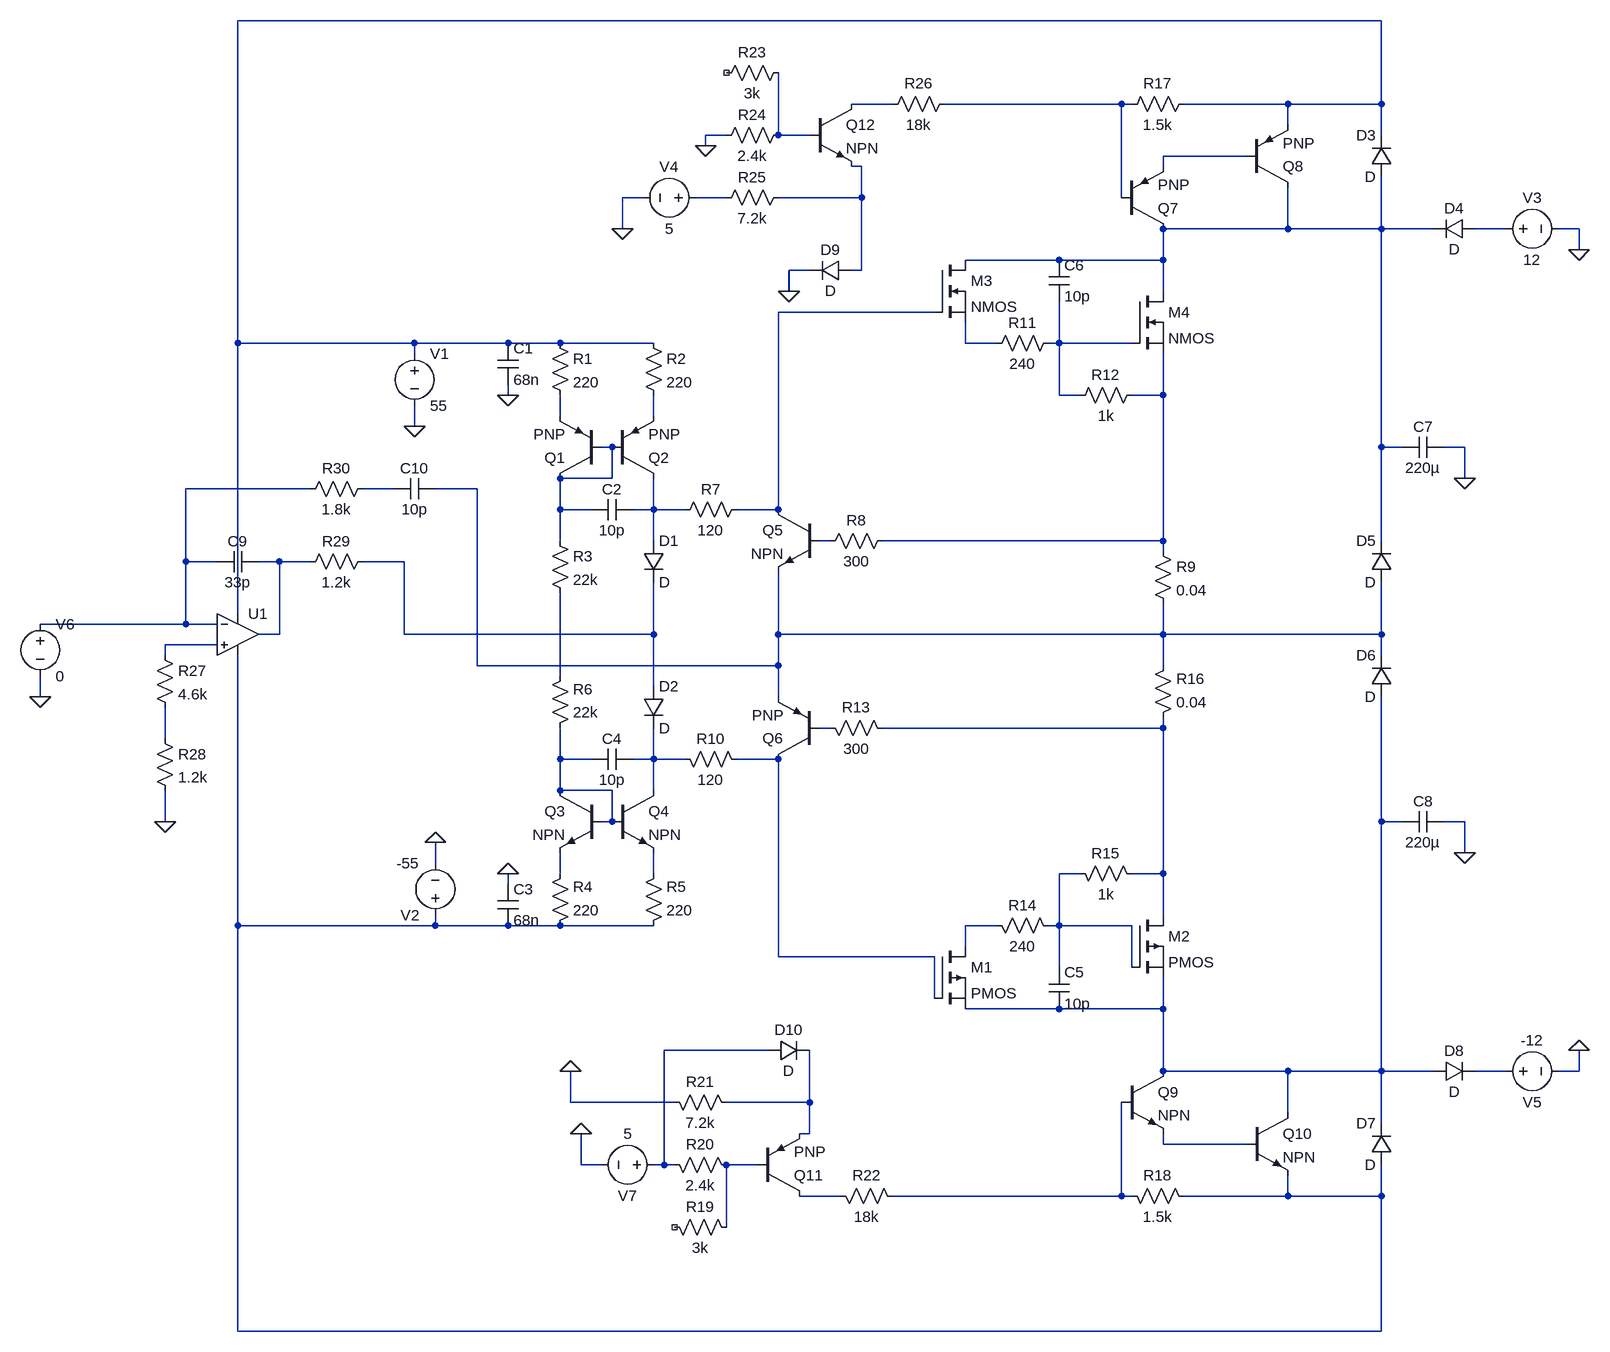
[diagram p0: schematic Модель главного усилителя канал базы.asc]
Модель главного усилителя канал базы.asc, the LTspice schematic file:
Version 4
SHEET 1 1748 1604
WIRE 1424 -416 -336 -416
WIRE 672 -288 608 -288
WIRE 1024 -288 752 -288
WIRE 1040 -288 1024 -288
WIRE 1280 -288 1120 -288
WIRE 1424 -288 1424 -416
WIRE 1424 -288 1280 -288
WIRE 1280 -256 1280 -288
WIRE 416 -240 384 -240
WIRE 496 -240 496 -336
WIRE 544 -240 496 -240
WIRE 1424 -240 1424 -288
WIRE 384 -224 384 -240
WIRE 1216 -208 1088 -208
WIRE 624 -192 608 -192
WIRE 1088 -192 1088 -208
WIRE 288 -144 256 -144
WIRE 416 -144 368 -144
WIRE 624 -144 624 -192
WIRE 624 -144 496 -144
WIRE 1024 -144 1024 -288
WIRE 256 -96 256 -144
WIRE 1280 -96 1280 -160
WIRE 1280 -96 1088 -96
WIRE 1424 -96 1424 -176
WIRE 1424 -96 1280 -96
WIRE 1504 -96 1424 -96
WIRE 1616 -96 1568 -96
WIRE 1728 -96 1696 -96
WIRE 1728 -64 1728 -96
WIRE 928 -48 784 -48
WIRE 1088 -48 1088 -96
WIRE 1088 -48 928 -48
WIRE 544 -32 512 -32
WIRE 624 -32 624 -144
WIRE 624 -32 608 -32
WIRE 512 0 512 -32
WIRE 1088 0 1088 -48
WIRE 736 32 496 32
WIRE -336 80 -336 -416
WIRE -64 80 -336 80
WIRE 80 80 -64 80
WIRE 160 80 80 80
WIRE 304 80 160 80
WIRE 784 80 784 48
WIRE 832 80 784 80
WIRE 928 80 928 16
WIRE 928 80 912 80
WIRE 1040 80 928 80
WIRE -64 96 -64 80
WIRE 80 160 80 144
WIRE 928 160 928 80
WIRE 960 160 928 160
WIRE 1088 160 1088 96
WIRE 1088 160 1040 160
WIRE 160 192 160 160
WIRE 304 192 304 160
WIRE -64 208 -64 176
WIRE 240 240 224 240
WIRE 1424 240 1424 -96
WIRE 1456 240 1424 240
WIRE 1552 240 1520 240
WIRE 240 288 240 240
WIRE 240 288 160 288
WIRE 1552 288 1552 240
WIRE -224 304 -416 304
WIRE -96 304 -144 304
WIRE 32 304 -32 304
WIRE 160 336 160 288
WIRE 208 336 160 336
WIRE 304 336 304 288
WIRE 304 336 272 336
WIRE 352 336 304 336
WIRE 496 336 496 32
WIRE 496 336 432 336
WIRE 160 384 160 336
WIRE 304 384 304 336
WIRE 576 384 560 384
WIRE 1088 384 1088 160
WIRE 1088 384 656 384
WIRE 1424 384 1424 240
WIRE 1088 400 1088 384
WIRE -416 416 -416 304
WIRE -368 416 -416 416
WIRE -272 416 -304 416
WIRE -224 416 -272 416
WIRE -80 416 -144 416
WIRE -336 496 -336 80
WIRE -416 512 -416 416
WIRE -416 512 -640 512
WIRE -368 512 -416 512
WIRE -272 528 -272 416
WIRE -272 528 -304 528
WIRE -80 528 -80 416
WIRE 304 528 304 448
WIRE 304 528 -80 528
WIRE 496 528 496 432
WIRE 1088 528 1088 480
WIRE 1088 528 496 528
WIRE 1424 528 1424 448
WIRE 1424 528 1088 528
WIRE -368 544 -448 544
WIRE -448 560 -448 544
WIRE 1424 560 1424 528
WIRE 32 576 32 304
WIRE 496 576 496 528
WIRE 496 576 32 576
WIRE 1088 576 1088 528
WIRE 160 592 160 464
WIRE 304 608 304 528
WIRE -640 624 -640 592
WIRE 496 624 496 576
WIRE 576 672 560 672
WIRE 1088 672 1088 656
WIRE 1088 672 656 672
WIRE -448 688 -448 640
WIRE 160 720 160 672
WIRE 208 720 160 720
WIRE 304 720 304 672
WIRE 304 720 272 720
WIRE 352 720 304 720
WIRE 496 720 432 720
WIRE 160 768 160 720
WIRE 240 768 160 768
WIRE 304 768 304 720
WIRE -448 816 -448 768
WIRE 240 816 240 768
WIRE 240 816 224 816
WIRE 1424 816 1424 624
WIRE 1456 816 1424 816
WIRE 1552 816 1520 816
WIRE 1552 864 1552 816
WIRE -32 880 -32 848
WIRE 160 896 160 864
WIRE 304 896 304 864
WIRE 960 896 928 896
WIRE 1088 896 1088 672
WIRE 1088 896 1040 896
WIRE 80 912 80 896
WIRE 1088 960 1088 896
WIRE -336 976 -336 560
WIRE -32 976 -32 960
WIRE -32 976 -336 976
WIRE 80 976 -32 976
WIRE 160 976 80 976
WIRE 304 976 160 976
WIRE 832 976 784 976
WIRE 928 976 928 896
WIRE 928 976 912 976
WIRE 1040 976 928 976
WIRE 784 1008 784 976
WIRE 496 1024 496 720
WIRE 736 1024 496 1024
WIRE 928 1040 928 976
WIRE 1040 1040 1040 976
WIRE 736 1088 736 1024
WIRE 928 1104 784 1104
WIRE 1088 1104 1088 1056
WIRE 1088 1104 928 1104
WIRE 480 1168 320 1168
WIRE 1088 1200 1088 1104
WIRE 1280 1200 1088 1200
WIRE 1424 1200 1424 816
WIRE 1424 1200 1280 1200
WIRE 1504 1200 1424 1200
WIRE 1616 1200 1568 1200
WIRE 1728 1200 1728 1168
WIRE 1728 1200 1696 1200
WIRE 176 1248 176 1200
WIRE 336 1248 176 1248
WIRE 544 1248 544 1168
WIRE 544 1248 416 1248
WIRE 1280 1264 1280 1200
WIRE 1424 1280 1424 1200
WIRE 544 1296 544 1248
WIRE 544 1296 528 1296
WIRE 1088 1312 1088 1296
WIRE 1216 1312 1088 1312
WIRE 192 1344 192 1296
WIRE 224 1344 192 1344
WIRE 320 1344 320 1168
WIRE 320 1344 304 1344
WIRE 336 1344 320 1344
WIRE 464 1344 416 1344
WIRE 592 1392 528 1392
WIRE 1024 1392 1024 1248
WIRE 1024 1392 672 1392
WIRE 1040 1392 1024 1392
WIRE 1280 1392 1280 1360
WIRE 1280 1392 1120 1392
WIRE 1424 1392 1424 1344
WIRE 1424 1392 1280 1392
WIRE 416 1440 416 1344
WIRE -336 1600 -336 976
WIRE 1424 1600 1424 1392
WIRE 1424 1600 -336 1600
FLAG 80 160 0
FLAG 80 896 0
FLAG -64 208 0
FLAG -32 848 0
FLAG 1728 -64 0
FLAG 1552 288 0
FLAG 1728 1168 0
FLAG 1552 864 0
FLAG 384 -224 0
FLAG 256 -96 0
FLAG 176 1200 0
FLAG 192 1296 0
FLAG 512 0 0
FLAG -448 816 0
FLAG -640 624 0
SYMBOL res 144 64 R0
SYMATTR InstName R1
SYMATTR Value 220
SYMATTR SpiceLine tol=1 pwr=0,125
SYMBOL cap 64 80 R0
SYMATTR InstName C1
SYMATTR Value 68n
SYMATTR SpiceLine V=250
SYMBOL pnp 224 288 R180
SYMATTR InstName Q1
SYMBOL pnp 240 288 M180
SYMATTR InstName Q2
SYMBOL res 288 64 R0
SYMATTR InstName R2
SYMATTR Value 220
SYMATTR SpiceLine tol=1 pwr=0,125
SYMBOL cap 272 320 R90
WINDOW 0 0 32 VBottom 2
WINDOW 3 32 32 VTop 2
SYMATTR InstName C2
SYMATTR Value 10p
SYMATTR SpiceLine V=100
SYMBOL res 144 368 R0
SYMATTR InstName R3
SYMATTR Value 22k
SYMATTR SpiceLine tol=1 pwr=0.125
SYMBOL diode 288 384 R0
SYMATTR InstName D1
SYMBOL res 144 992 M180
WINDOW 0 36 76 Left 2
WINDOW 3 36 40 Left 2
SYMATTR InstName R4
SYMATTR Value 220
SYMATTR SpiceLine tol=1 pwr=0,125
SYMBOL cap 64 976 M180
WINDOW 0 24 56 Left 2
WINDOW 3 24 8 Left 2
SYMATTR InstName C3
SYMATTR Value 68n
SYMATTR SpiceLine V=250
SYMBOL res 288 992 M180
WINDOW 0 36 76 Left 2
WINDOW 3 36 40 Left 2
SYMATTR InstName R5
SYMATTR Value 220
SYMATTR SpiceLine tol=1 pwr=0,125
SYMBOL cap 272 736 M270
WINDOW 0 32 32 VTop 2
WINDOW 3 0 32 VBottom 2
SYMATTR InstName C4
SYMATTR Value 10p
SYMATTR SpiceLine V=100
SYMBOL res 144 688 M180
WINDOW 0 36 76 Left 2
WINDOW 3 36 40 Left 2
SYMATTR InstName R6
SYMATTR Value 22k
SYMATTR SpiceLine tol=1 pwr=0.125
SYMBOL diode 288 608 R0
SYMATTR InstName D2
SYMBOL npn 224 768 M0
SYMATTR InstName Q3
SYMBOL npn 240 768 R0
SYMATTR InstName Q4
SYMBOL voltage -64 80 R0
WINDOW 123 0 0 Left 0
WINDOW 39 0 0 Left 0
SYMATTR InstName V1
SYMATTR Value 55
SYMBOL voltage -32 976 R180
WINDOW 123 0 0 Left 0
WINDOW 39 0 0 Left 0
SYMATTR InstName V2
SYMATTR Value -55
SYMBOL res 448 320 R90
WINDOW 0 0 56 VBottom 2
WINDOW 3 32 56 VTop 2
SYMATTR InstName R7
SYMATTR Value 120
SYMATTR SpiceLine tol=1 pwr=0.125
SYMBOL npn 560 336 M0
SYMATTR InstName Q5
SYMBOL res 672 368 R90
WINDOW 0 0 56 VBottom 2
WINDOW 3 32 56 VTop 2
SYMATTR InstName R8
SYMATTR Value 300
SYMATTR SpiceLine tol=1 pwr=0.125
SYMBOL nmos 736 -48 R0
SYMATTR InstName M3
SYMBOL res 928 64 R90
WINDOW 0 0 56 VBottom 2
WINDOW 3 32 56 VTop 2
SYMATTR InstName R11
SYMATTR Value 240
SYMATTR SpiceLine tol=1 pwr=0.125
SYMBOL cap 912 -48 R0
SYMATTR InstName C6
SYMATTR Value 10p
SYMATTR SpiceLine V=100
SYMBOL nmos 1040 0 R0
SYMATTR InstName M4
SYMBOL res 1056 144 R90
WINDOW 0 0 56 VBottom 2
WINDOW 3 32 56 VTop 2
SYMATTR InstName R12
SYMATTR Value 1k
SYMATTR SpiceLine tol=1 pwr=0.125
SYMBOL res 1072 384 R0
SYMATTR InstName R9
SYMATTR Value 0.04
SYMATTR SpiceLine tol=1 pwr=30
SYMBOL res 448 736 M270
WINDOW 0 32 56 VTop 2
WINDOW 3 0 56 VBottom 2
SYMATTR InstName R10
SYMATTR Value 120
SYMATTR SpiceLine tol=1 pwr=0.125
SYMBOL res 672 688 M270
WINDOW 0 32 56 VTop 2
WINDOW 3 0 56 VBottom 2
SYMATTR InstName R13
SYMATTR Value 300
SYMATTR SpiceLine tol=1 pwr=0.125
SYMBOL res 928 992 M270
WINDOW 0 32 56 VTop 2
WINDOW 3 0 56 VBottom 2
SYMATTR InstName R14
SYMATTR Value 240
SYMATTR SpiceLine tol=1 pwr=0.125
SYMBOL cap 912 1104 M180
WINDOW 0 24 56 Left 2
WINDOW 3 24 8 Left 2
SYMATTR InstName C5
SYMATTR Value 10p
SYMATTR SpiceLine V=100
SYMBOL res 1056 912 M270
WINDOW 0 32 56 VTop 2
WINDOW 3 0 56 VBottom 2
SYMATTR InstName R15
SYMATTR Value 1k
SYMATTR SpiceLine tol=1 pwr=0.125
SYMBOL res 1072 672 M180
WINDOW 0 36 76 Left 2
WINDOW 3 36 40 Left 2
SYMATTR InstName R16
SYMATTR Value 0.04
SYMATTR SpiceLine tol=1 pwr=30
SYMBOL pnp 560 720 R180
SYMATTR InstName Q6
SYMBOL pmos 736 1008 R0
SYMATTR InstName M1
SYMBOL pmos 1040 960 R0
SYMATTR InstName M2
SYMBOL pnp 1024 -96 M180
SYMATTR InstName Q7
SYMBOL res 1136 -304 R90
WINDOW 0 0 56 VBottom 2
WINDOW 3 32 56 VTop 2
SYMATTR InstName R17
SYMATTR Value 1.5k
SYMATTR SpiceLine tol=1 pwr=0.125
SYMBOL pnp 1216 -160 M180
SYMATTR InstName Q8
SYMBOL diode 1440 -176 R180
WINDOW 0 24 64 Left 2
WINDOW 3 24 0 Left 2
SYMATTR InstName D3
SYMBOL diode 1568 -112 R90
WINDOW 0 0 32 VBottom 2
WINDOW 3 32 32 VTop 2
SYMATTR InstName D4
SYMBOL voltage 1600 -96 R270
WINDOW 0 32 56 VTop 2
WINDOW 3 -32 56 VBottom 2
WINDOW 123 0 0 Left 0
WINDOW 39 0 0 Left 0
SYMATTR InstName V3
SYMATTR Value 12
SYMBOL diode 1440 448 R180
WINDOW 0 24 64 Left 2
WINDOW 3 24 0 Left 2
SYMATTR InstName D5
SYMBOL diode 1440 624 R180
WINDOW 0 24 64 Left 2
WINDOW 3 24 0 Left 2
SYMATTR InstName D6
SYMBOL cap 1520 224 R90
WINDOW 0 0 32 VBottom 2
WINDOW 3 32 32 VTop 2
SYMATTR InstName C7
SYMATTR Value 220µ
SYMATTR SpiceLine V=250
SYMBOL res 1136 1408 M270
WINDOW 0 32 56 VTop 2
WINDOW 3 0 56 VBottom 2
SYMATTR InstName R18
SYMATTR Value 1.5k
SYMATTR SpiceLine tol=1 pwr=0.125
SYMBOL voltage 1600 1200 M90
WINDOW 0 32 56 VTop 2
WINDOW 3 -32 56 VBottom 2
WINDOW 123 0 0 Left 0
WINDOW 39 0 0 Left 0
SYMATTR InstName V5
SYMATTR Value -12
SYMBOL diode 1440 1344 R180
WINDOW 0 24 64 Left 2
WINDOW 3 24 0 Left 2
SYMATTR InstName D7
SYMBOL diode 1504 1216 R270
WINDOW 0 32 32 VTop 2
WINDOW 3 0 32 VBottom 2
SYMATTR InstName D8
SYMBOL npn 1024 1200 R0
SYMATTR InstName Q9
SYMBOL npn 1216 1264 R0
SYMATTR InstName Q10
SYMBOL cap 1520 800 R90
WINDOW 0 0 32 VBottom 2
WINDOW 3 32 32 VTop 2
SYMATTR InstName C8
SYMATTR Value 220µ
SYMATTR SpiceLine V=250
SYMBOL res 512 -352 R90
WINDOW 0 0 56 VBottom 2
WINDOW 3 32 56 VTop 2
SYMATTR InstName R23
SYMATTR Value 3k
SYMATTR SpiceLine tol=1 pwr=0.125
SYMBOL res 512 -256 R90
WINDOW 0 0 56 VBottom 2
WINDOW 3 32 56 VTop 2
SYMATTR InstName R24
SYMATTR Value 2.4k
SYMATTR SpiceLine tol=1 pwr=0.125
SYMBOL res 512 -160 R90
WINDOW 0 0 56 VBottom 2
WINDOW 3 32 56 VTop 2
SYMATTR InstName R25
SYMATTR Value 7.2k
SYMATTR SpiceLine tol=1 pwr=0.125
SYMBOL npn 544 -288 R0
SYMATTR InstName Q12
SYMBOL res 768 -304 R90
WINDOW 0 0 56 VBottom 2
WINDOW 3 32 56 VTop 2
SYMATTR InstName R26
SYMATTR Value 18k
SYMATTR SpiceLine tol=1 pwr=0.125
SYMBOL voltage 384 -144 R90
WINDOW 0 -32 56 VBottom 2
WINDOW 3 32 56 VTop 2
WINDOW 123 0 0 Left 0
WINDOW 39 0 0 Left 0
SYMATTR InstName V4
SYMATTR Value 5
SYMBOL res 432 1456 M270
WINDOW 0 32 56 VTop 2
WINDOW 3 0 56 VBottom 2
SYMATTR InstName R19
SYMATTR Value 3k
SYMATTR SpiceLine tol=1 pwr=0.125
SYMBOL res 432 1360 M270
WINDOW 0 32 56 VTop 2
WINDOW 3 0 56 VBottom 2
SYMATTR InstName R20
SYMATTR Value 2.4k
SYMATTR SpiceLine tol=1 pwr=0.125
SYMBOL res 432 1264 M270
WINDOW 0 32 56 VTop 2
WINDOW 3 0 56 VBottom 2
SYMATTR InstName R21
SYMATTR Value 7.2k
SYMATTR SpiceLine tol=1 pwr=0.125
SYMBOL res 688 1408 M270
WINDOW 0 32 56 VTop 2
WINDOW 3 0 56 VBottom 2
SYMATTR InstName R22
SYMATTR Value 18k
SYMATTR SpiceLine tol=1 pwr=0.125
SYMBOL pnp 464 1392 M180
SYMATTR InstName Q11
SYMBOL voltage 320 1344 M270
WINDOW 0 -32 56 VBottom 2
WINDOW 3 32 56 VTop 2
WINDOW 123 0 0 Left 0
WINDOW 39 0 0 Left 0
SYMATTR InstName V7
SYMATTR Value 5
SYMBOL diode 608 -48 R90
WINDOW 0 0 32 VBottom 2
WINDOW 3 32 32 VTop 2
SYMATTR InstName D9
SYMBOL diode 480 1184 R270
WINDOW 0 32 32 VTop 2
WINDOW 3 0 32 VBottom 2
SYMATTR InstName D10
SYMBOL OpAmps\\UniversalOpAmp -336 528 R0
SYMATTR InstName U1
SYMBOL res -464 544 R0
SYMATTR InstName R27
SYMATTR Value 4.6k
SYMATTR SpiceLine tol=1 pwr=0.125
SYMBOL res -464 672 R0
SYMATTR InstName R28
SYMATTR Value 1.2k
SYMATTR SpiceLine tol=1 pwr=0.125
SYMBOL cap -304 400 R90
WINDOW 0 0 32 VBottom 2
WINDOW 3 32 32 VTop 2
SYMATTR InstName C9
SYMATTR Value 33p
SYMATTR SpiceLine V=100
SYMBOL res -128 400 R90
WINDOW 0 0 56 VBottom 2
WINDOW 3 32 56 VTop 2
SYMATTR InstName R29
SYMATTR Value 1.2k
SYMATTR SpiceLine tol=1 pwr=0.125
SYMBOL res -128 288 R90
WINDOW 0 0 56 VBottom 2
WINDOW 3 32 56 VTop 2
SYMATTR InstName R30
SYMATTR Value 1.8k
SYMATTR SpiceLine tol=1 pwr=0.125
SYMBOL cap -32 288 R90
WINDOW 0 0 32 VBottom 2
WINDOW 3 32 32 VTop 2
SYMATTR InstName C10
SYMATTR Value 10p
SYMATTR SpiceLine V=100
SYMBOL voltage -640 496 R0
WINDOW 123 0 0 Left 0
WINDOW 39 0 0 Left 0
SYMATTR InstName V6
SYMATTR Value 0

The netlist it stands for:
* Модель главного усилителя канал базы.asc
R1 N001 N014 220 tol=1 pwr=0,125
C1 N001 0 68n V=250
Q1 N016 N016 N014 0 PNP
Q2 N020 N016 N015 0 PNP
R2 N001 N015 220 tol=1 pwr=0,125
C2 N020 N016 10p V=100
R3 N016 N025 22k tol=1 pwr=0.125
D1 N020 N023 D
R4 N036 N033 220 tol=1 pwr=0,125
C3 N036 0 68n V=250
R5 N036 N034 220 tol=1 pwr=0,125
C4 N030 N029 10p V=100
R6 N029 N025 22k tol=1 pwr=0.125
D2 N023 N030 D
Q3 N029 N029 N033 0 NPN
Q4 N030 N029 N034 0 NPN
V1 N001 0 55
V2 N036 0 -55
R7 N010 N020 120 tol=1 pwr=0.125
Q5 N010 N021 N019 0 NPN
R8 N013 N021 300 tol=1 pwr=0.125
M3 N008 N010 N011 N011 NMOS
R11 N012 N011 240 tol=1 pwr=0.125
C6 N008 N012 10p V=100
M4 N008 N012 N013 N013 NMOS
R12 N013 N012 1k tol=1 pwr=0.125
R9 N013 N019 0.04 tol=1 pwr=30
R10 N031 N030 120 tol=1 pwr=0.125
R13 N027 N026 300 tol=1 pwr=0.125
R14 N035 N037 240 tol=1 pwr=0.125
C5 N032 N035 10p V=100
R15 N027 N035 1k tol=1 pwr=0.125
R16 N027 N019 0.04 tol=1 pwr=30
Q6 N031 N026 N019 0 PNP
M1 N037 N031 N032 N032 PMOS
M2 N027 N035 N032 N032 PMOS
Q7 N008 N003 N005 0 PNP
R17 N001 N003 1.5k tol=1 pwr=0.125
Q8 N008 N005 N001 0 PNP
D3 N008 N001 D
D4 N009 N008 D
V3 N009 0 12
D5 N019 N008 D
D6 N032 N019 D
C7 0 N008 220µ V=250
R18 N036 N044 1.5k tol=1 pwr=0.125
V5 N039 0 -12
D7 N036 N032 D
D8 N032 N039 D
Q9 N032 N044 N041 0 NPN
Q10 N032 N041 N036 0 NPN
C8 0 N032 220µ V=250
R23 N004 NC_01 3k tol=1 pwr=0.125
R24 N004 0 2.4k tol=1 pwr=0.125
R25 N006 N007 7.2k tol=1 pwr=0.125
Q12 N002 N004 N006 0 NPN
R26 N003 N002 18k tol=1 pwr=0.125
V4 N007 0 5
R19 N042 NC_02 3k tol=1 pwr=0.125
R20 N042 N038 2.4k tol=1 pwr=0.125
R21 N040 0 7.2k tol=1 pwr=0.125
R22 N044 N043 18k tol=1 pwr=0.125
Q11 N043 N042 N040 0 PNP
V7 N038 0 5
D9 N006 0 D
D10 N038 N040 D
XU1 N024 N017 N001 N036 N022 level1 Avol=1Meg GBW=10Meg Vos=0 En=0 Enk=0 In=0 Ink=0 Rin=500Meg  ; pins In+ In- V+ V- OUT
R27 N024 N028 4.6k tol=1 pwr=0.125
R28 N028 0 1.2k tol=1 pwr=0.125
C9 N022 N017 33p V=100
R29 N023 N022 1.2k tol=1 pwr=0.125
R30 N018 N017 1.8k tol=1 pwr=0.125
C10 N019 N018 10p V=100
V6 N017 0 0
.model D D
.lib standard.dio
.model NPN NPN
.model PNP PNP
.lib standard.bjt
.model NMOS NMOS
.model PMOS PMOS
.lib standard.mos
.lib UniversalOpAmp1.lib
.backanno
.end